# Altium schematic sheet STC12C5A60S2底板.SchDoc
size A3
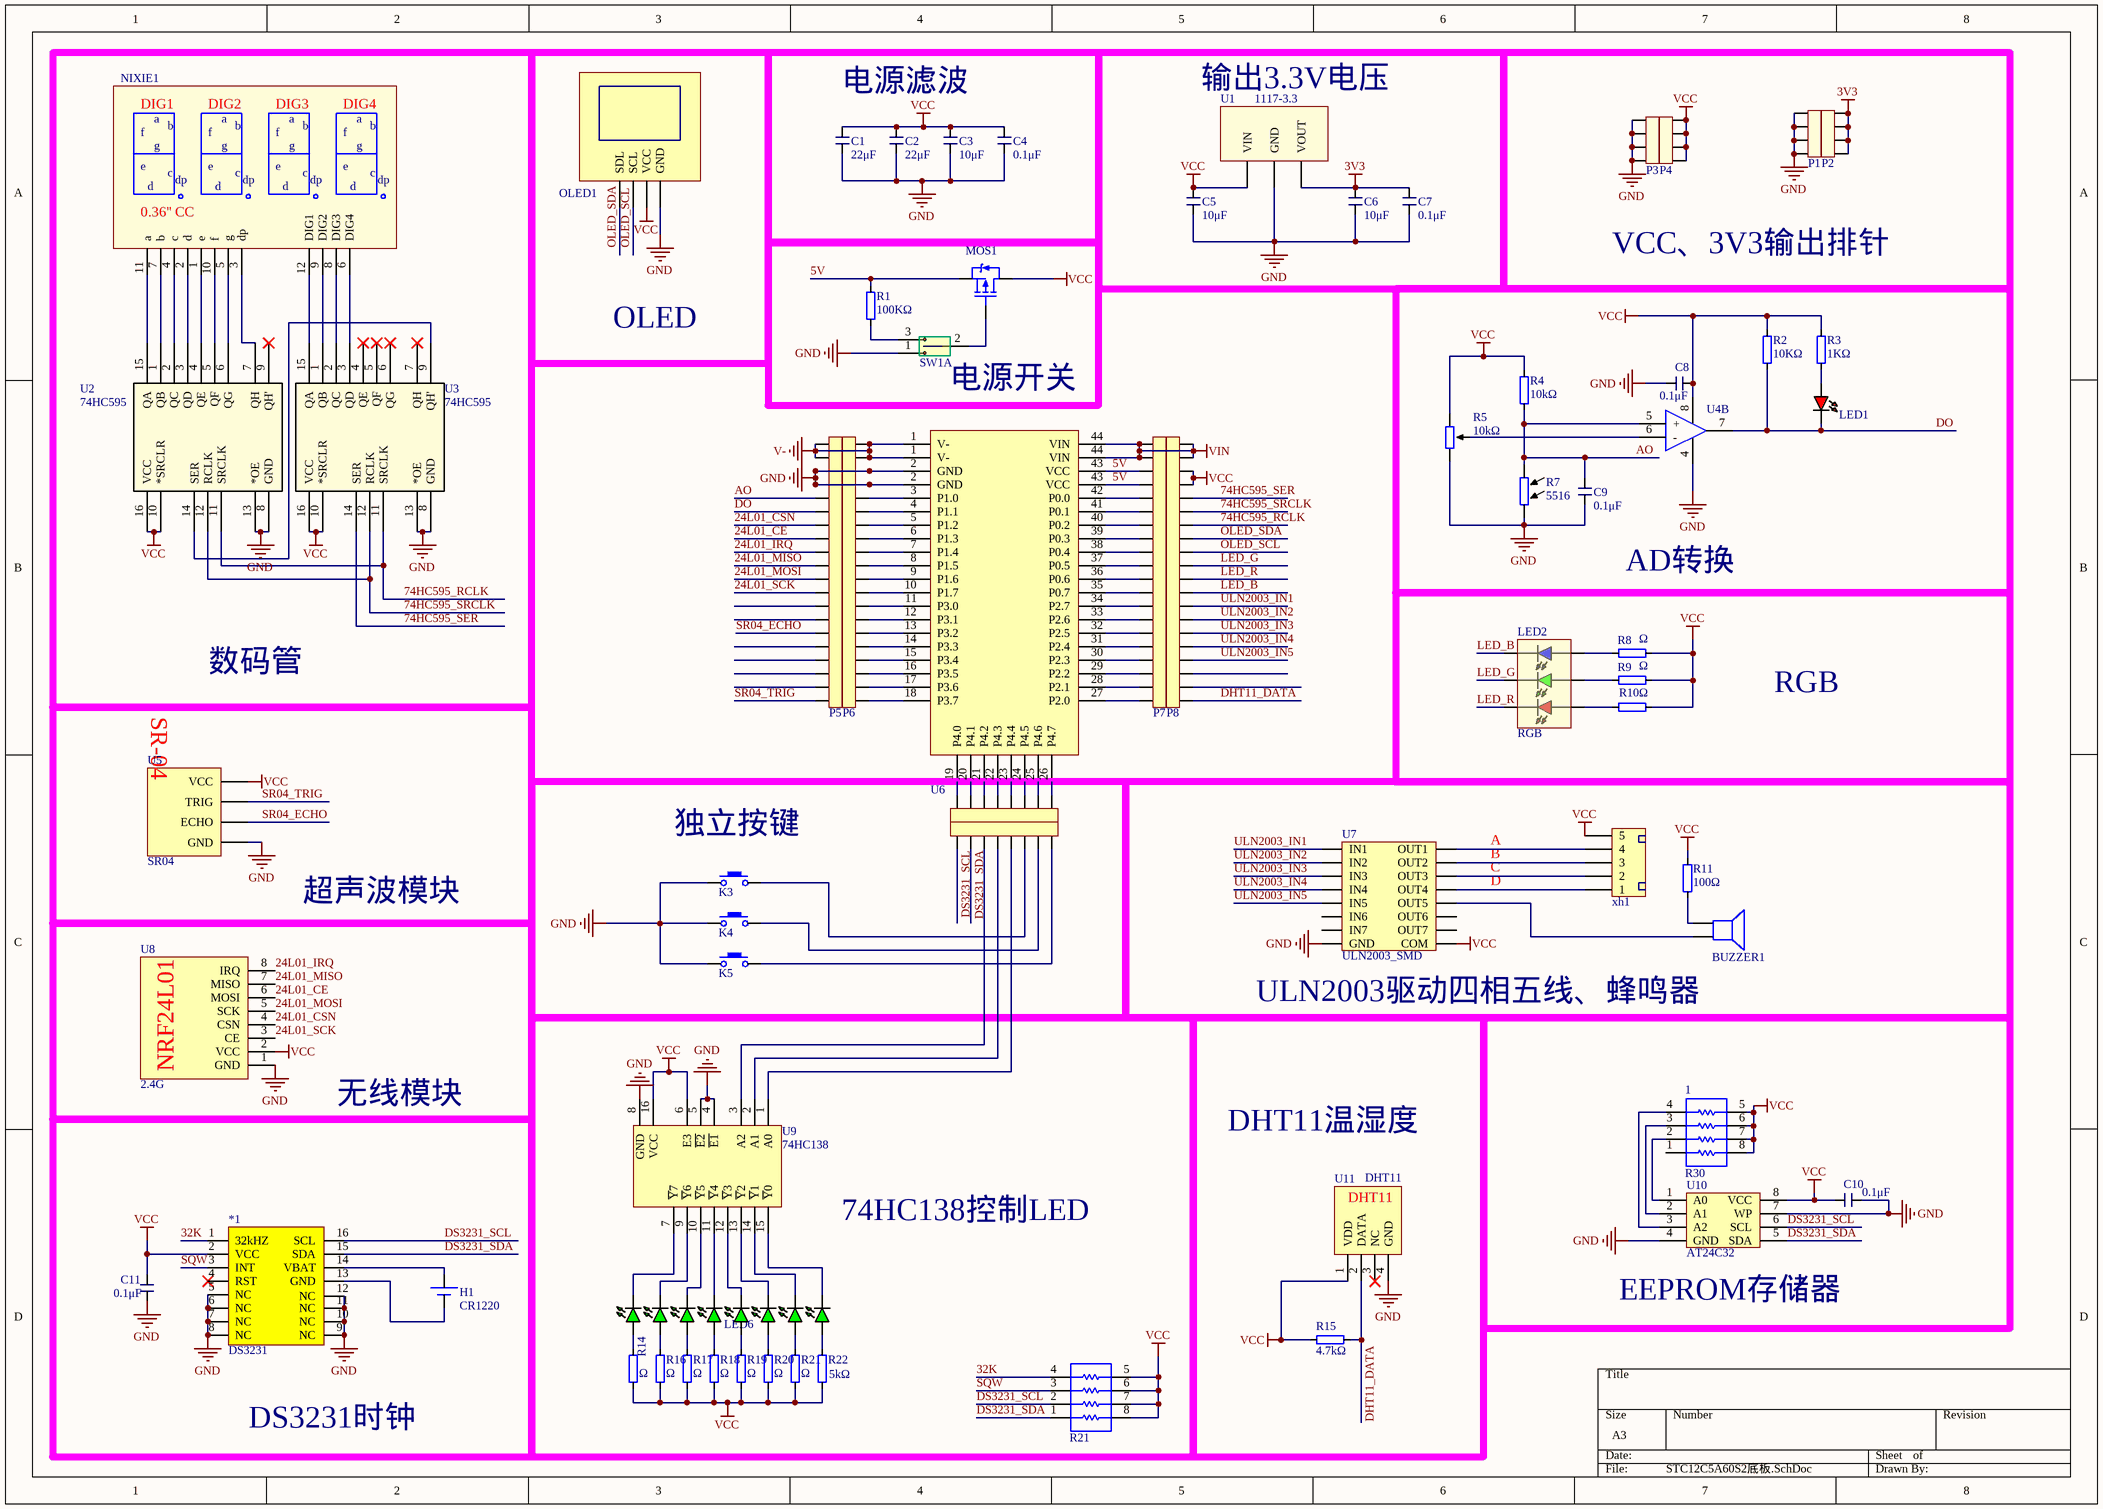
[diagram p0: STC12C5A60S2底板.SchDoc]

## Parts
1  R30  [排阻(0603)]
2  R21  [排阻(0603)]
*1  DS3231  [DS3231]
BUZZER1  BUZZER 9.6X5.5_4MM  [BUZZER9.6x4_4mm]  (value not drawn)
C1  22μF  [C_0805]
C2  22μF  [C_0805]
C3  10μF  [C_0805]
C4  0.1μF  [C_0805]
C5  10μF  [C_0805]
C6  10μF  [C_0805]
C7  0.1μF  [C_0805]
C8  0.1μF  [C_0805]
C9  0.1μF  [C_0805]
C10  0.1μF  [C_0805]
C11  0.1μF  [C_0805]
H1  CR1220  [holder_CR1220_SMD]
K3  TACT SWITCH_4_DIP  [TACT SWITCH_4_DIP]  (value not drawn)
K4  TACT SWITCH_4_DIP  [TACT SWITCH_4_DIP]  (value not drawn)
K5  TACT SWITCH_4_DIP  [TACT SWITCH_4_DIP]  (value not drawn)
LED1  LED_0603-R  [LED_0603-R]  (value not drawn)
LED2  RGB  [LED 5050_RGB]
LED3  LED_0603-G  [LED_0603-G]  (value not drawn)
LED4  LED_0603-G  [LED_0603-G]  (value not drawn)
LED5  LED_0603-G  [LED_0603-G]  (value not drawn)
LED6  LED_0603-G  [LED_0603-G]  (value not drawn)
LED7  LED_0603-G  [LED_0603-G]  (value not drawn)
LED8  LED_0603-G  [LED_0603-G]  (value not drawn)
LED9  LED_0603-G  [LED_0603-G]  (value not drawn)
LED10  LED_0603-G  [LED_0603-G]  (value not drawn)
MOS1  SI2301  [SOT_23_3]  (value not drawn)
NIXIE1  Nixie Tube_CC(0.36in)_4  [Nixie Tube_4(0.36in)]  (value not drawn)
OLED1  0.96''  [OLED 0.96'']  (value not drawn)
P1  PIN4  [PIN_4]  (value not drawn)
P2  PIN4  [PIN_4]  (value not drawn)
P3  PIN4  [PIN_4]  (value not drawn)
P4  PIN4  [PIN_4]  (value not drawn)
P5  PIN20  [PIN_20]  (value not drawn)
P6  PIN20  [PIN_20]  (value not drawn)
P7  PIN20  [PIN_20]  (value not drawn)
P8  PIN20  [PIN_20]  (value not drawn)
P9  PIN8  [PIN_8]  (value not drawn)
P10  PIN8  [PIN_8]  (value not drawn)
R1  100KΩ  [R_0805]
R2  10KΩ  [R_0805]
R3  1KΩ  [R_0805]
R4  10kΩ  [R_0805]
R5  10kΩ  [RP_3362P]
R7  5516  [GM55-55XX]
R8  Ω  [R_0805]
R9  Ω  [R_0805]
R10  Ω  [R_0805]
R11  100Ω  [R_0805]
R14  Ω  [R_0805]
R15  4.7kΩ  [R_0805]
R16  Ω  [R_0805]
R17  Ω  [R_0805]
R18  Ω  [R_0805]
R19  Ω  [R_0805]
R20  Ω  [R_0805]
R21  Ω  [R_0805]
R22  5kΩ  [R_0805]
SW1  switchi_slide(SMD)  [switchi_slide(SMD)]  (value not drawn)  (part A of 2)
U1  1117-3.3  [SOT_223]
U2  74HC595  [SOP_16]
U3  74HC595  [SOP_16]
U4  LM393_DIP  [SOP_8]  (value not drawn)  (part B of 2)
U5  SR04  [SR04]
U6  socket  [STC12_moudle]  (value not drawn)
U7  ULN2003_SMD  [SOP_16]
U8  2.4G  [NRF24L01]
U9  74HC138  [SOP_16]
U10  AT24C32  [SOP_8]
U11  DHT11  [DHT11]
xh1  XH2.54_5  [XH2.54_5]  (value not drawn)

## Blocks framed on the sheet
数码管: NIXIE1 U2 U3
OLED: OLED1
电源滤波: C1-C4
输出3.3V电压: C5-C7 U1
VCC、3V3输出排针: P1-P4
电源开关: MOS1 R1 SW1
AD转换: C8 C9 LED1 R2-R5 R7 U4
超声波模块: U5
独立按键: K3-K5 P9 P10
ULN2003驱动四相五线、蜂鸣器: BUZZER1 R11 U7 xh1
74HC138控制LED: 2 LED3-LED10 R14 R16-R22 U9
EEPROM存储器: 1 C10 U10

## Nets
3V3: C6.1 C7.1 P2.1 P2.2 P2.3 P2.4 U1.2(VOUT)
GND: *1.5(NC) *1.6(NC) *1.7(NC) *1.8(NC) *1.9(NC) *1.10(NC) *1.11(NC) *1.12(NC) C1.2 C2.2 C3.2 C4.2 C5.2 C6.2 C7.2 C8.1 C9.2 C10.2 C11.2 K3.1 K4.1 K5.1 OLED1.1(GND) P1.1 P1.2 P1.3 P1.4 P3.1 P3.2 P3.3 P3.4 P5.17 P5.18 P6.17 P6.18 R5.3 R7.2 SW1.1 U1.1(GND) U2.8(GND) U2.13(*OE) U3.8(GND) U3.13(*OE) U4.4(GND) U5.4(GND) U6.2(GND) U7.8(GND) U8.1(GND) U9.4(~{E1}) U9.5(~{E2}) U9.8(GND) U10.4(GND) U10.7(WP) U11.4(GND)
V-: P5.19 P5.20 P6.19 P6.20 U6.1(V-)
VCC: 1.5 1.6 1.7 1.8 2.5 2.6 2.7 2.8 *1.2(VCC) C1.1 C2.1 C3.1 C4.1 C5.1 C8.2 C10.1 C11.1 MOS1.3(D) OLED1.2(VCC) P4.1 P4.2 P4.3 P4.4 P8.17 P8.18 R2.2 R3.2 R4.1 R5.1 R8.2 R9.2 R10.2 R11.2 R14.1 R15.2 R16.1 R17.1 R18.1 R19.1 R20.1 R21.1 R22.1 U1.3(VIN) U2.10(*SRCLR) U2.16(VCC) U3.10(*SRCLR) U3.16(VCC) U4.8(VCC) U5.1(VCC) U7.9(COM) U8.2(VCC) U9.6(E3) U9.16(VCC) U10.8(VCC) U11.1(VDD) xh1.5
VIN: P7.19 P7.20 P8.19 P8.20 U6.44(VIN)
5V: MOS1.2(S) P7.17 P7.18 R1.2 U6.43(VCC)
24L01_CE: P5.13 U8.6(MOSI)
24L01_CSN: P5.14 U8.4(CSN)
24L01_IRQ: P5.12 U8.8(IRQ)
24L01_MISO: P5.11 U8.7(MISO)
24L01_MOSI: P5.10 U8.5(SCK)
24L01_SCK: P5.9 U8.3(CE)
32K: 2.4 *1.1(32kHZ)
74HC595_RCLK: P8.14 U2.11(SRCLK) U3.11(SRCLK)
74HC595_SER: P8.16 U3.14(SER)
74HC595_SRCLK: P8.15 U2.12(RCLK) U3.12(RCLK)
AO: C9.1 P5.16 R4.2 R7.1 U4.5(+)
DHT11_DATA: P8.1 R15.1 U11.2(DATA)
DO: LED1.2 P5.15 R2.1 U4.7
DS3231_SCL: 2.2 *1.16(SCL) P10.1 U10.6(SCL)
DS3231_SDA: 2.1 *1.15(SDA) P10.2 U10.5(SDA)
LED_B: LED2.1 P8.9
LED_G: LED2.5 P8.11
LED_R: LED2.3 P8.10
OLED_SCL: OLED1.3(SCL) P8.12
OLED_SDA: OLED1.4(SDL) P8.13
SQW: 2.3 *1.3(INT)
SR04_ECHO: P5.6 U5.3(ECHO)
SR04_TRIG: P5.1 U5.2(TRIG)
ULN2003_IN1: P8.8 U7.1(IN1)
ULN2003_IN2: P8.7 U7.2(IN2)
ULN2003_IN3: P8.6 U7.3(IN3)
ULN2003_IN4: P8.5 U7.4(IN4)
ULN2003_IN5: P8.4 U7.5(IN5)
Net1_2: 1.2 U10.1(A0)
Net1_3: 1.3 U10.2(A1)
Net1_4: 1.4 U10.3(A2)
Net*1_13: *1.13(GND) H1.2(-)
Net*1_14: *1.14(VBAT) H1.1(+)
NetBUZZER1_1: BUZZER1.1(+) R11.1
NetBUZZER1_2: BUZZER1.2 U7.12(OUT5)
NetK3_2: K3.2 P10.6
NetK4_2: K4.2 P10.7
NetK5_2: K5.2 P10.8
NetLED1_1: LED1.1 R3.1
NetLED2_2: LED2.2 R8.1
NetLED2_4: LED2.4 R10.1
NetLED2_6: LED2.6 R9.1
NetLED3_1: LED3.1 R14.2
NetLED3_2: LED3.2 U9.7(~{Y}7)
NetLED4_1: LED4.1 R16.2
NetLED4_2: LED4.2 U9.9(~{Y}6)
NetLED5_1: LED5.1 R17.2
NetLED5_2: LED5.2 U9.10(~{Y}5)
NetLED6_1: LED6.1 R18.2
NetLED6_2: LED6.2 U9.11(~{Y}4)
NetLED7_1: LED7.1 R19.2
NetLED7_2: LED7.2 U9.12(~{Y}3)
NetLED8_1: LED8.1 R20.2
NetLED8_2: LED8.2 U9.13(~{Y}2)
NetLED9_1: LED9.1 R21.2
NetLED9_2: LED9.2 U9.14(~{Y}1)
NetLED10_1: LED10.1 R22.2
NetLED10_2: LED10.2 U9.15(~{Y}0)
NetMOS1_1: MOS1.1(G) SW1.2
NetNIXIE1_1: NIXIE1.1(e) U2.4(QE)
NetNIXIE1_2: NIXIE1.2(d) U2.3(QD)
NetNIXIE1_3: NIXIE1.3(dp) U2.7(QH)
NetNIXIE1_4: NIXIE1.4(c) U2.2(QC)
NetNIXIE1_5: NIXIE1.5(g) U2.6(QG)
NetNIXIE1_6: NIXIE1.6(DIG4) U3.3(QD)
NetNIXIE1_7: NIXIE1.7(b) U2.1(QB)
NetNIXIE1_8: NIXIE1.8(DIG3) U3.2(QC)
NetNIXIE1_9: NIXIE1.9(DIG2) U3.1(QB)
NetNIXIE1_10: NIXIE1.10(f) U2.5(QF)
NetNIXIE1_11: NIXIE1.11(a) U2.15(QA)
NetNIXIE1_12: NIXIE1.12(DIG1) U3.15(QA)
NetP6_1: P6.1 U6.18(P3.7)
NetP6_2: P6.2 U6.17(P3.6)
NetP6_3: P6.3 U6.16(P3.5)
NetP6_4: P6.4 U6.15(P3.4)
NetP6_5: P6.5 U6.14(P3.3)
NetP6_6: P6.6 U6.13(P3.2)
NetP6_7: P6.7 U6.12(P3.1)
NetP6_8: P6.8 U6.11(P3.0)
NetP6_9: P6.9 U6.10(P1.7)
NetP6_10: P6.10 U6.9(P1.6)
NetP6_11: P6.11 U6.8(P1.5)
NetP6_12: P6.12 U6.7(P1.4)
NetP6_13: P6.13 U6.6(P1.3)
NetP6_14: P6.14 U6.5(P1.2)
NetP6_15: P6.15 U6.4(P1.1)
NetP6_16: P6.16 U6.3(P1.0)
NetP7_1: P7.1 U6.27(P2.0)
NetP7_2: P7.2 U6.28(P2.1)
NetP7_3: P7.3 U6.29(P2.2)
NetP7_4: P7.4 U6.30(P2.3)
NetP7_5: P7.5 U6.31(P2.4)
NetP7_6: P7.6 U6.32(P2.5)
NetP7_7: P7.7 U6.33(P2.6)
NetP7_8: P7.8 U6.34(P2.7)
NetP7_9: P7.9 U6.35(P0.7)
NetP7_10: P7.10 U6.36(P0.6)
NetP7_11: P7.11 U6.37(P0.5)
NetP7_12: P7.12 U6.38(P0.4)
NetP7_13: P7.13 U6.39(P0.3)
NetP7_14: P7.14 U6.40(P0.2)
NetP7_15: P7.15 U6.41(P0.1)
NetP7_16: P7.16 U6.42(P0.0)
NetP9_1: P9.1 U6.19(P4.0)
NetP9_2: P9.2 U6.20(P4.1)
NetP9_3: P9.3 U6.21(P4.2)
NetP9_4: P9.4 U6.22(P4.3)
NetP9_5: P9.5 U6.23(P4.4)
NetP9_6: P9.6 U6.24(P4.5)
NetP9_7: P9.7 U6.25(P4.6)
NetP9_8: P9.8 U6.26(P4.7)
NetP10_3: P10.3 U9.3(A2)
NetP10_4: P10.4 U9.2(A1)
NetP10_5: P10.5 U9.1(A0)
NetR1_1: R1.1 SW1.3
NetR5_2: R5.2 U4.6(-)
NetU2_14: U2.14(SER) U3.9(QH')
NetU7_13: U7.13(OUT4) xh1.1
NetU7_14: U7.14(OUT3) xh1.2
NetU7_15: U7.15(OUT2) xh1.3
NetU7_16: U7.16(OUT1) xh1.4

Not connected (* = marked no-connect by the designer): 1 1; *1 4(RST)*; P5 2 3 4 5 7 8; P8 2 3; U2 9(QH')*; U3 4(QE)* 5(QF)* 6(QG)* 7(QH)*; U7 6(IN6) 7(IN7) 10(OUT7) 11(OUT6); U11 3(NC)*

## Notes on the sheet
- RGB
- B
- A
- C
- D
- 无线模块
- DHT11温湿度
- DS3231时钟
- (in symbol Nixie Tube_CC(0.36in)_4) 0.36'' CC
- (in symbol SR04) SR-04

## Library data of the parts
1 2 = 排阻(0603)
C1-C11 = C_0805
H1 = holder_CR1220_SMD
LED2 = LED_5050_RGB
OLED1 = OLED 0.96''_module
R1-R4 R8-R11 R14-R22 = R_0805
R5 = RP_3362P
R7 = GM55-55XX
U1 = AMS1117-3.3
U6 = STC12C_module
U8 = NRF24L01